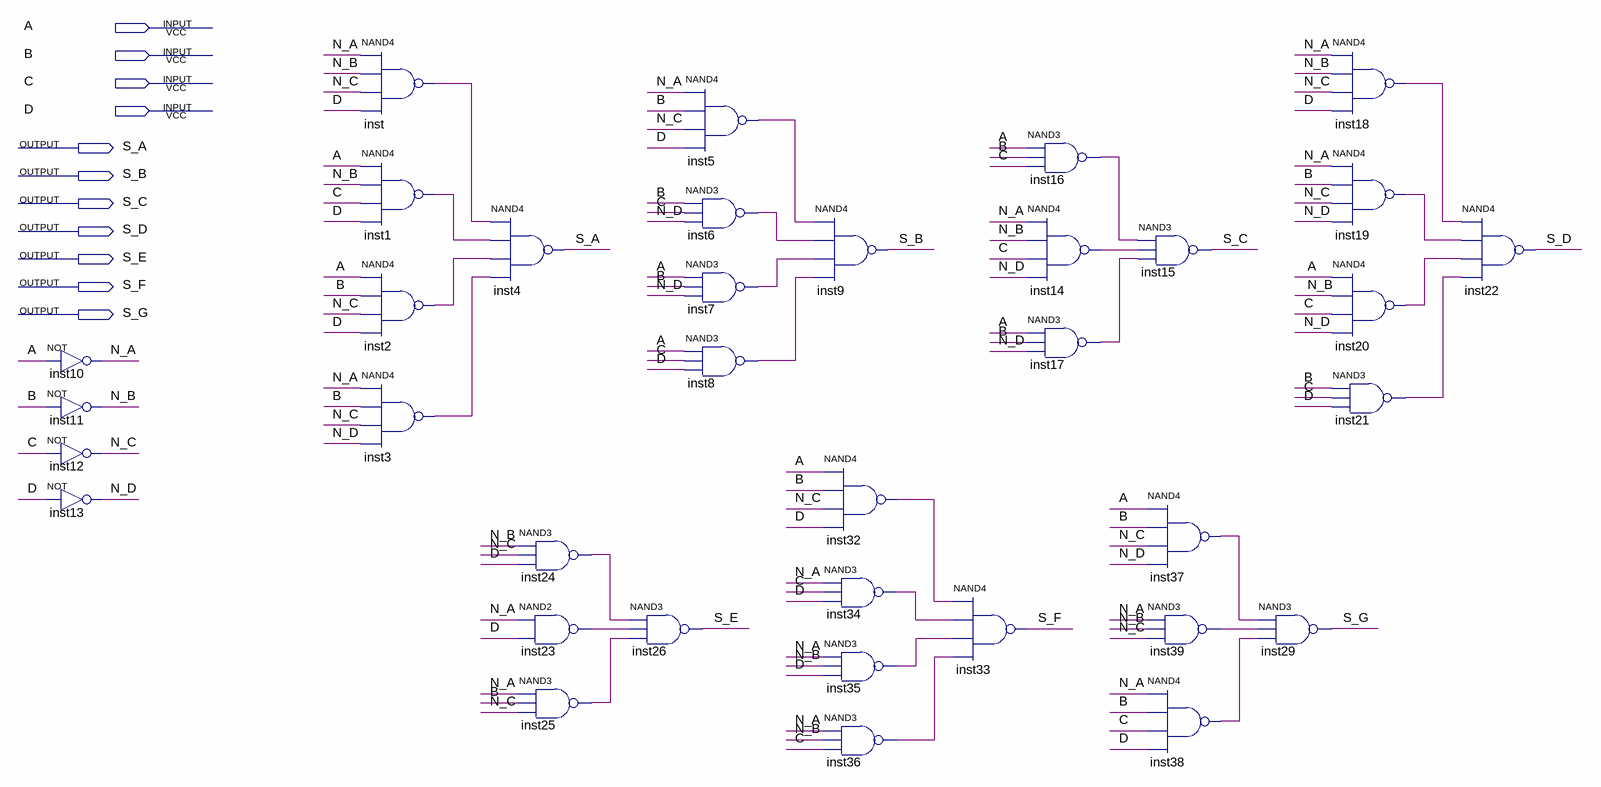
[diagram p0: schematic sheet]
// Quartus schematic decoder.bdf as structural Verilog: 36 symbols, 11 pins
module decoder (
  input  A,
  input  B,
  input  C,
  input  D,
  output S_A,
  output S_B,
  output S_C,
  output S_D,
  output S_E,
  output S_F,
  output S_G
);

  wire inst1_out, inst2_out, inst3_out, inst5_out, inst6_out, inst7_out, inst8_out, inst14_out, inst16_out,
       inst17_out, inst18_out, inst19_out, inst20_out, inst21_out, inst23_out, inst24_out, inst25_out,
       inst32_out, inst34_out, inst35_out, inst36_out, inst37_out, inst38_out, inst39_out, inst_out, N_A,
       N_B, N_C, N_D;

  not inst10 (N_A, A);
  not inst11 (N_B, B);
  not inst12 (N_C, C);
  not inst13 (N_D, D);
  nand inst (inst_out, N_A, N_B, N_C, D);
  nand inst1 (inst1_out, A, N_B, C, D);
  nand inst2 (inst2_out, A, B, N_C, D);
  nand inst3 (inst3_out, N_A, B, N_C, N_D);
  nand inst4 (S_A, inst_out, inst1_out, inst2_out, inst3_out);
  nand inst24 (inst24_out, N_B, N_C, D);
  nand inst23 (inst23_out, N_A, D);
  nand inst25 (inst25_out, N_A, B, N_C);
  nand inst26 (S_E, inst24_out, inst23_out, inst25_out);
  nand inst5 (inst5_out, N_A, B, N_C, D);
  nand inst6 (inst6_out, B, C, N_D);
  nand inst7 (inst7_out, A, B, N_D);
  nand inst8 (inst8_out, A, C, D);
  nand inst9 (S_B, inst5_out, inst6_out, inst7_out, inst8_out);
  nand inst32 (inst32_out, A, B, N_C, D);
  nand inst34 (inst34_out, N_A, C, D);
  nand inst35 (inst35_out, N_A, N_B, D);
  nand inst36 (inst36_out, N_A, N_B, C);
  nand inst33 (S_F, inst32_out, inst34_out, inst35_out, inst36_out);
  nand inst16 (inst16_out, A, B, C);
  nand inst14 (inst14_out, N_A, N_B, C, N_D);
  nand inst17 (inst17_out, A, B, N_D);
  nand inst15 (S_C, inst16_out, inst14_out, inst17_out);
  nand inst37 (inst37_out, A, B, N_C, N_D);
  nand inst39 (inst39_out, N_A, N_B, N_C);
  nand inst38 (inst38_out, N_A, B, C, D);
  nand inst29 (S_G, inst37_out, inst39_out, inst38_out);
  nand inst18 (inst18_out, N_A, N_B, N_C, D);
  nand inst19 (inst19_out, N_A, B, N_C, N_D);
  nand inst20 (inst20_out, A, N_B, C, N_D);
  nand inst21 (inst21_out, B, C, D);
  nand inst22 (S_D, inst18_out, inst19_out, inst20_out, inst21_out);
endmodule
